# Altium schematic sheet chicker.SchDoc
size A4; SheetNumber: 7
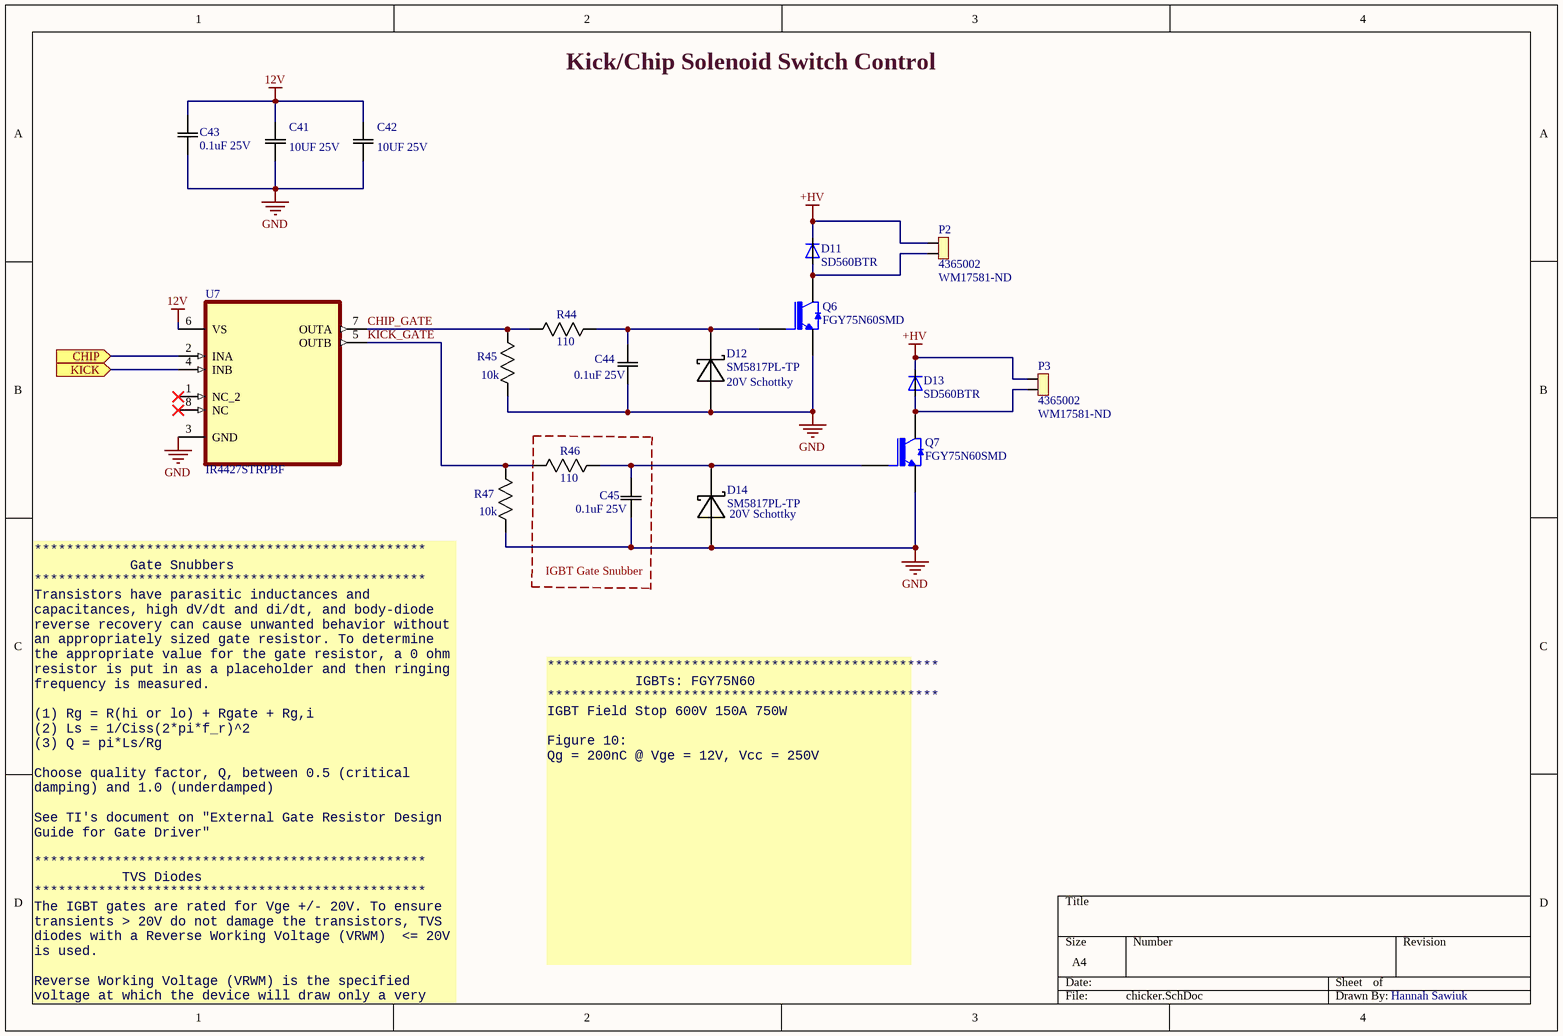
[diagram p0: chicker.SchDoc]

## Parts
C41  10UF 25V  [1206]
C42  10UF 25V  [1206]
C43  0.1uF 25V  [0805]
C44  0.1uF 25V  [0805]
C45  0.1uF 25V  [0805]
D11  SD560BTR  [DO-214AA]
D12  SM5817PL-TP  [SOD-123]
D13  SD560BTR  [DO-214AA]
D14  SM5817PL-TP  [SOD-123]
P2  4365002  Supplier Part Number 2: WM17581-ND  [43650-02]
P3  4365002  Supplier Part Number 2: WM17581-ND  [43650-02]
Q6  FGY75N60SMD  [TO-247-3]
Q7  FGY75N60SMD  [TO-247-3]
R44  110  [0805]
R45  10k  [0805]
R46  110  [0805]
R47  10k  [0805]
U7  IR4427STRPBF  [8-SOIC]

## Ports
CHIP (in), KICK (in)

## Nets
12V: C41.1(C1) C42.1(C1) C43.2(C2) U7.6(VS)
+HV: D11.C D13.C P2.1 P3.1
GND: C41.2(C2) C42.2(C2) C43.1(C1) C44.1(C1) C45.1(C1) D12.A D14.A Q6.3(E) Q7.3(E) R45.2(R2) R47.2(R2) U7.3(GND)
CHIP: U7.2(INA) ; port CHIP
CHIP_GATE: R44.2(R2) R45.1(R1) U7.7(OUTA)
KICK: U7.4(INB) ; port KICK
KICK_GATE: R46.2(R2) R47.1(R1) U7.5(OUTB)
NetC44_2: C44.2(C2) D12.C(K) Q6.1(G) R44.1(R1)
NetC45_2: C45.2(C2) D14.C(K) Q7.1(G) R46.1(R1)
NetD11_A: D11.A P2.2 Q6.2(C)
NetD13_A: D13.A P3.2 Q7.2(C)

Not connected (* = marked no-connect by the designer): U7 1(NC_2)* 8(NC)*

## Notes on the sheet
- Kick/Chip Solenoid Switch Control
- (near D12) 20V Schottky
- (near D14) 20V Schottky
- IGBT Gate Snubber
- *************************************************
  IGBTs: FGY75N60
  *************************************************
  IGBT Field Stop 600V 150A 750W
  Figure 10:
  Qg = 200nC @ Vge = 12V, Vcc = 250V
- (near R47) *************************************************
  Gate Snubbers
  *************************************************
  Transistors have parasitic inductances and capacitances, high dV/dt and di/dt, and body-diode reverse recovery can cause unwanted behavior without an appropriately sized gate resistor. To determine the appropriate value for the gate resistor, a 0 ohm resistor is put in as a placeholder and then ringing frequency is measured.
  (1) Rg = R(hi or lo) + Rgate + Rg,i
  (2) Ls = 1/Ciss(2*pi*f_r)^2
  (3) Q = pi*Ls/Rg
  Choose quality factor, Q, between 0.5 (critical damping) and 1.0 (underdamped)
  See TI's document on "External Gate Resistor Design Guide for Gate Driver"
  *************************************************
  TVS Diodes
  *************************************************
  The IGBT gates are rated for Vge +/- 20V. To ensure transients > 20V do not damage the transistors, TVS diodes with a Reverse Working Voltage (VRWM)  <= 20V is used.
  Reverse Working Voltage (VRWM) is the specified voltage at which the device will draw only a very small leakage current.
- Hannah Sawiuk

## Library data of the parts
C41 C42 = CAP 10uF 25V: CAP CER 10UF 25V X5R 1206; Tolerance: 10%; Package: 1206; Value: 10uF; Rating: 25V; Temperature Coefficient: X5R; Operating Temperature: -55°C ~ 85°C
C43-C45 = CAP 0.1uF 25V: CAP CER 0.1UF 25V X7R 0805; Tolerance: 10%; Value: 0.1uF; Temperature Coefficient: X7R; Rating: 25V; Operating Temperature: -55°C ~ 125°C
D11 D13 = DIODE STANDARD 600V 5A: Diode Standard 600V 5A Surface Mount SMB; Supplier 1: Digi-Key; Supplier Part Number 1: 1655-1530-1-ND
D12 D14 = DIODE SCHOTTKY 20V 1A: Diode Schottky 20V 1A Surface Mount SOD-123FL; MF: Micro Commercial Co; ComponentLink1Description: digikey; ComponentLink1URL: https://www.digikey.ca/product-detail/en/on-semiconductor/MBR0540T1G/MBR0540T1GOSCT-ND/917967; Digikey: SM5817PL-TPMSCT-ND; Digikey Link: https://www.digikey.ca/product-detail/en/micro-commercial-co/SM5817PL-TP/SM5817PL-TPMSCT-ND/1793410; MP: SM5817PL-TP; Voltage Rating: 20V; Package: SOD-123; Current Rating: 1A
P2 P3 = CN MOLEX 4365002XX: MOLEX MICROFIT 2CKT RIGHT THRU; MF: MOLEX; MP: 4365002XX; Digikey: WM17581-ND; Digikey Link: https://www.digikey.com/en/products/detail/molex/0436500205/3310532?s=N4IgTCBcDaICwGYBsBWADGsaUgLoF8g; Package: Microfit; Price: 1.44 CAD; Value: N/A; Supplier 1: Digi-Key
Q6 Q7 = FGY75N60SMD: IGBT Field Stop 600V 150A 750W Through Hole PowerTO-247-3; MF: ON Semiconductor; Vge max: ±20V; Topology: Field Stop IGBT; Vce max: 600V; Package: TO-247 Fairchild Semiconductor; MP: FGY75N60SMD; Ic max: 150A; Power: 750W; Supplier 1: Digi-Key; Supplier Part Number 1: FGY75N60SMDFS-ND
R44 R46 = RES 110.0 1/8W - 1%: RES SMD 110 OHM 1% 1/8W 0805; Power (Watts): 0.125W; Package: 0805; Value: 110; Tolerance: 1%
R45 R47 = RES 10k 1/8W - 1%: RES SMD 10K OHM 1% 1/8W 0805; Power (Watts): 0.125W; Package: 0805; Value: 10k; Tolerance: 1%
U7 = IR4427STRPBF: Low-Side Gate Driver IC Non-Inverting 8-SOIC; MF: Infineon Technologies; Package: SOIC-8 Infineon; Price: None; Availability: Unavailable; MP: IR4427STRPBF; SnapEDA_Link: https://www.snapeda.com/parts/IR4427STRPBF/Infineon%20Technologies/view-part/1815787/?ref=snap; Value: *; Supplier 1: Digi-Key; Supplier Part Number 1: IR4427SPBFCT-ND